# EAGLE design Clock (EAGLE 9.6.2)
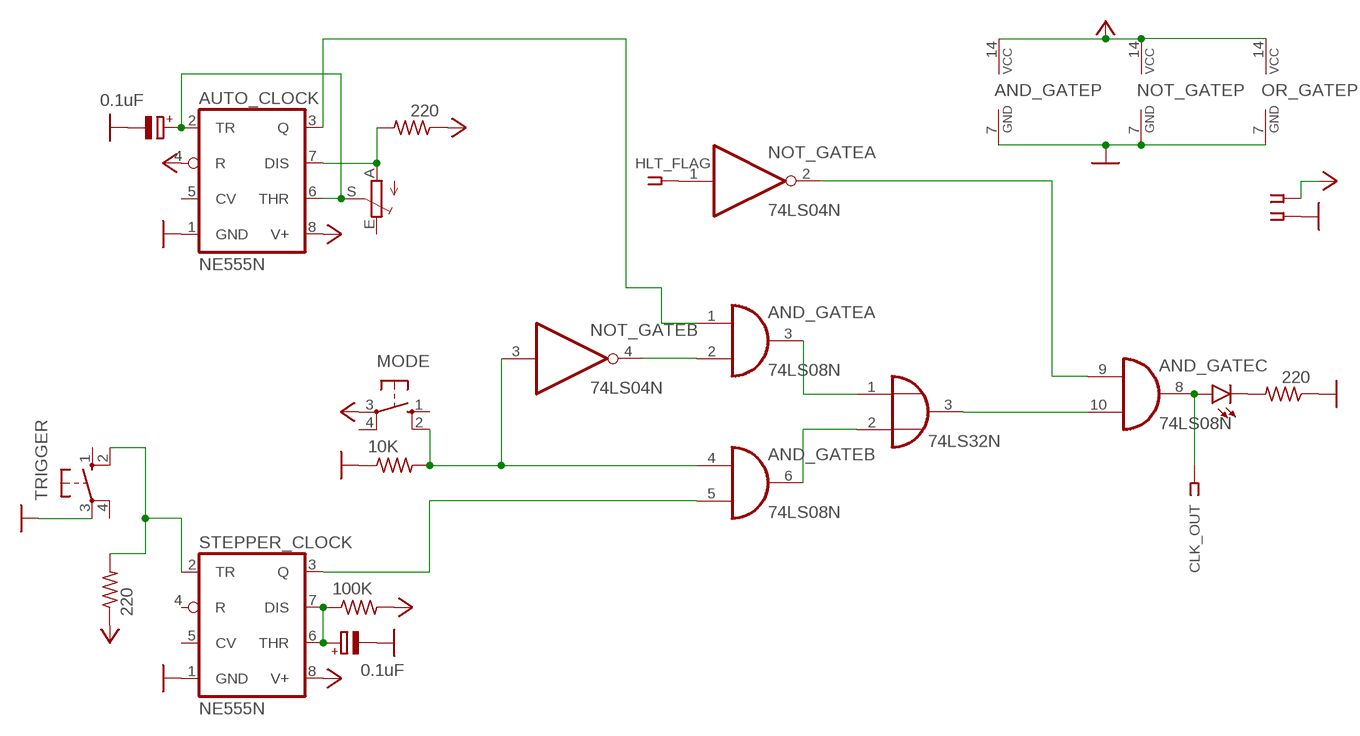
[diagram p0: schematic, sheet 1]

## Parts
AND_GATE  74LS08N  [DIL14]
AUTO_CLOCK  NE555N  [DIL08]
C1  0.1uF  CPOL-EUE2-5  [E2-5]
C2  0.1uF  CPOL-EUE2-5  [E2-5]
CLK_OUT  SSW-101-02-G-S-RA  [SSW-101-02-G-S-RA]
CLOCK  LED5MM  [LED5MM]
FREQUENCY  TRIM_EU-RJ9W  [RJ9W]
GND  SSW-101-02-G-S-RA  [SSW-101-02-G-S-RA]
HLT_FLAG  SSW-101-02-G-S-RA  [SSW-101-02-G-S-RA]
MODE  10-XX  [B3F-10XX]
NOT_GATE  74LS04N  [DIL14]
OR_GATE  74LS32N  [DIL14]
R2  220  R-US_0204/7  [0204/7]
R3  100K  R-US_0204/7  [0204/7]
R4  10K  R-US_0204/7  [0204/7]
R5  220  R-US_0204/7  [0204/7]
R6  220  R-US_0204/7  [0204/7]
STEPPER_CLOCK  NE555N  [DIL08]
TRIGGER  10-XX  [B3F-10XX]
VCC  SSW-101-02-G-S-RA  [SSW-101-02-G-S-RA]

## Nets
+5V: AND_GATE.14(P:VCC) AUTO_CLOCK.4(R) AUTO_CLOCK.8(V+) MODE.3(P) NOT_GATE.14(P:VCC) OR_GATE.14(P:VCC) R2.1 R3.2 R6.1 STEPPER_CLOCK.8(V+) VCC.1
GND: AND_GATE.7(P:GND) AUTO_CLOCK.1(GND) C1.- C2.- GND.1 NOT_GATE.7(P:GND) OR_GATE.7(P:GND) R4.1 R5.1 STEPPER_CLOCK.1(GND) TRIGGER.3(P)
N$1: C2.+ R3.1 STEPPER_CLOCK.6(THR) STEPPER_CLOCK.7(DIS)
N$2: R2.2 STEPPER_CLOCK.2(TR) TRIGGER.2(S1)
N$3: CLOCK.K(C) R5.2
N$4: AND_GATE.5(B:I1) STEPPER_CLOCK.3(Q)
N$5: AUTO_CLOCK.2(TR) AUTO_CLOCK.6(THR) C1.+ FREQUENCY.S
N$6: AND_GATE.1(A:I0) AUTO_CLOCK.3(Q)
N$7: AND_GATE.8(C:O) CLK_OUT.1 CLOCK.A
N$9: AND_GATE.2(A:I1) NOT_GATE.4(B:O)
N$10: AND_GATE.4(B:I0) MODE.2(S1) NOT_GATE.3(B:I) R4.2
N$11: AND_GATE.10(C:I1) OR_GATE.3(A:O)
N$12: AND_GATE.9(C:I0) NOT_GATE.2(A:O)
N$13: AND_GATE.3(A:O) OR_GATE.1(A:I0)
N$14: AND_GATE.6(B:O) OR_GATE.2(A:I1)
N$15: HLT_FLAG.1 NOT_GATE.1(A:I)
N$16: AUTO_CLOCK.7(DIS) FREQUENCY.A R6.2
Unconnected: AND_GATE.11(D:O) AND_GATE.12(D:I0) AND_GATE.13(D:I1) AUTO_CLOCK.5(CV) FREQUENCY.E MODE.1(S) MODE.4(P1) NOT_GATE.5(C:I) NOT_GATE.6(C:O) NOT_GATE.8(D:O) NOT_GATE.9(D:I) NOT_GATE.10(E:O) NOT_GATE.11(E:I) NOT_GATE.12(F:O) NOT_GATE.13(F:I) OR_GATE.4(B:I0) OR_GATE.5(B:I1) OR_GATE.6(B:O) OR_GATE.8(C:O) OR_GATE.9(C:I0) OR_GATE.10(C:I1) OR_GATE.11(D:O) OR_GATE.12(D:I0) OR_GATE.13(D:I1) STEPPER_CLOCK.4(R) STEPPER_CLOCK.5(CV) TRIGGER.1(S) TRIGGER.4(P1)

## Library data of the parts
AND_GATE = 74xx-eu:74*08: Quad 2-input AND gate
AUTO_CLOCK STEPPER_CLOCK = linear:*555: TIMER
C1 C2 = rcl:CPOL-EU: POLARIZED CAPACITOR, European symbol; SPICEPREFIX: C
CLK_OUT GND HLT_FLAG VCC = con-samtec:SSW-101-02-G-S: THROUGH-HOLE .025" SQ POST SOCKET Source: Samtec SSW.pdf; MF: Samtec Inc.; MPN: SSW-101-02-G-S-RA; OC_FARNELL: unknown; OC_NEWARK: 11P9337
CLOCK = led:LED: LED OSRAM: - CHIPLED LG R971, LG N971, LY N971, LG Q971, LY Q971, LO R971, LY R971 LH N974, LH R974 LS Q976, LO Q976, LY Q976 LO Q996 - Hyper CHIPLED LW Q18S LB Q993, LB Q99A, LB R99A - SideLED LS A670, LO A670, LY A670, LG A670, LP A670 LB A673, LV A673, LT A673, LW A673 LH A674 LY A675 LS A676, LA A676, LO A676, LY A676, LW A676 LS A679, LY A679, LG A679 - Hyper Micro SIDELED® LS Y876, LA Y876, LO Y876, LY Y876 LT Y87S - SmartLED LW L88C, LW L88S LB L89C, LB L89S, LG L890 LS L89K, LO L89K, LY L89K LS L896, LA L896, LO L896, LY L896 - TOPLED LS T670, LO T670, LY T670, LG T670, LP T670 LSG T670, LSP T670, LSY T670, LOP T670, LYG T670 LG T671, LOG T671, LSG T671 LB T673, LV T673, LT T673, LW T673 LH T674 LS T676, LA T676, LO T676, LY T676, LB T676, LH T676, LSB T676, LW T676 LB T67C, LV T67C, LT T67C, LS T67K, LO T67K, LY T67K, LW E67C LS E67B, LA E67B, LO E67B, LY E67B, LB E67C, LV E67C, LT E67C LW T67C LS T679, LY T679, LG T679 LS T770, LO T770, LY T770, LG T770, LP T770 LB T773, LV T773, LT T773, LW T773 LH T774 LS E675, LA E675, LY E675, LS T675 LS T776, LA T776, LO T776, LY T776, LB T776 LHGB T686 LT T68C, LB T68C - Hyper Mini TOPLED® LB M676 - Mini TOPLED Santana® LG M470 LS M47K, LO M47K, LY M47K Source: http://www.osram.convergy.de LUXEON: - LUMILED® LXK2-PW12-R00, LXK2-PW12-S00, LXK2-PW14-U00, LXK2-PW14-V00 LXK2-PM12-R00, LXK2-PM12-S00, LXK2-PM14-U00 LXK2-PE12-Q00, LXK2-PE12-R00, LXK2-PE12-S00, LXK2-PE14-T00, LXK2-PE14-U00 LXK2-PB12-K00, LXK2-PB12-L00, LXK2-PB12-M00, LXK2-PB14-N00, LXK2-PB14-P00, LXK2-PB14-Q00 LXK2-PR12-L00, LXK2-PR12-M00, LXK2-PR14-Q00, LXK2-PR14-R00 LXK2-PD12-Q00, LXK2-PD12-R00, LXK2-PD12-S00 LXK2-PH12-R00, LXK2-PH12-S00 LXK2-PL12-P00, LXK2-PL12-Q00, LXK2-PL12-R00 Source: www.luxeon.com KINGBRIGHT: KA-3528ASYC Source: www.kingbright.com
FREQUENCY = pot:TRIM_EU-: POTENTIOMETER
MODE TRIGGER = switch-omron:10-XX: OMRON SWITCH; MPN: B3F-1000; OC_FARNELL: 176432; OC_NEWARK: 36M3542
NOT_GATE = 74xx-eu:74*04: Hex INVERTER
OR_GATE = 74xx-eu:74*32: Quad 2-input OR gate
R2-R6 = rcl:R-US_: RESISTOR, American symbol; SPICEPREFIX: R

## Board
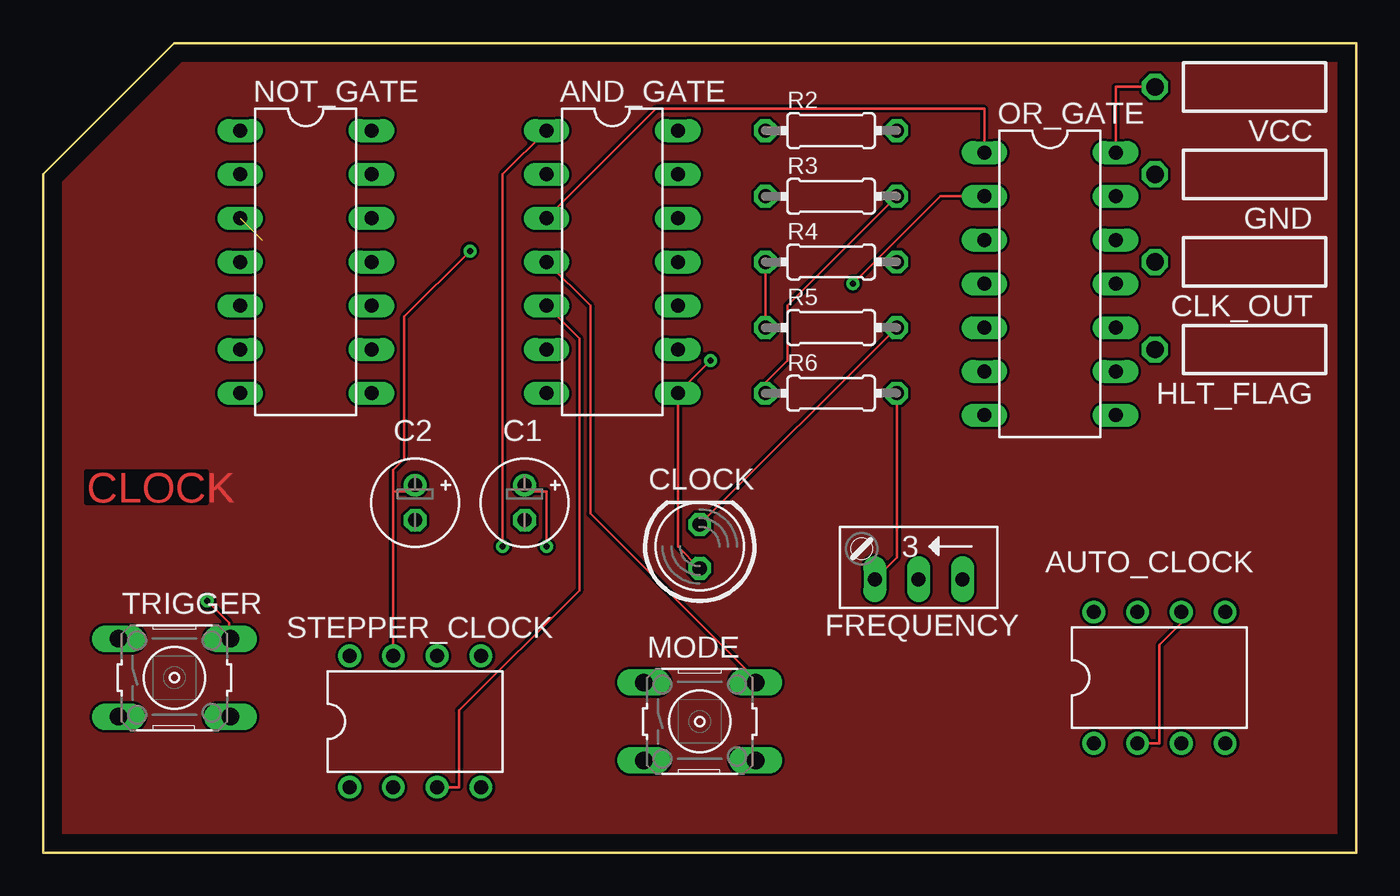
[diagram p1: board, top side]
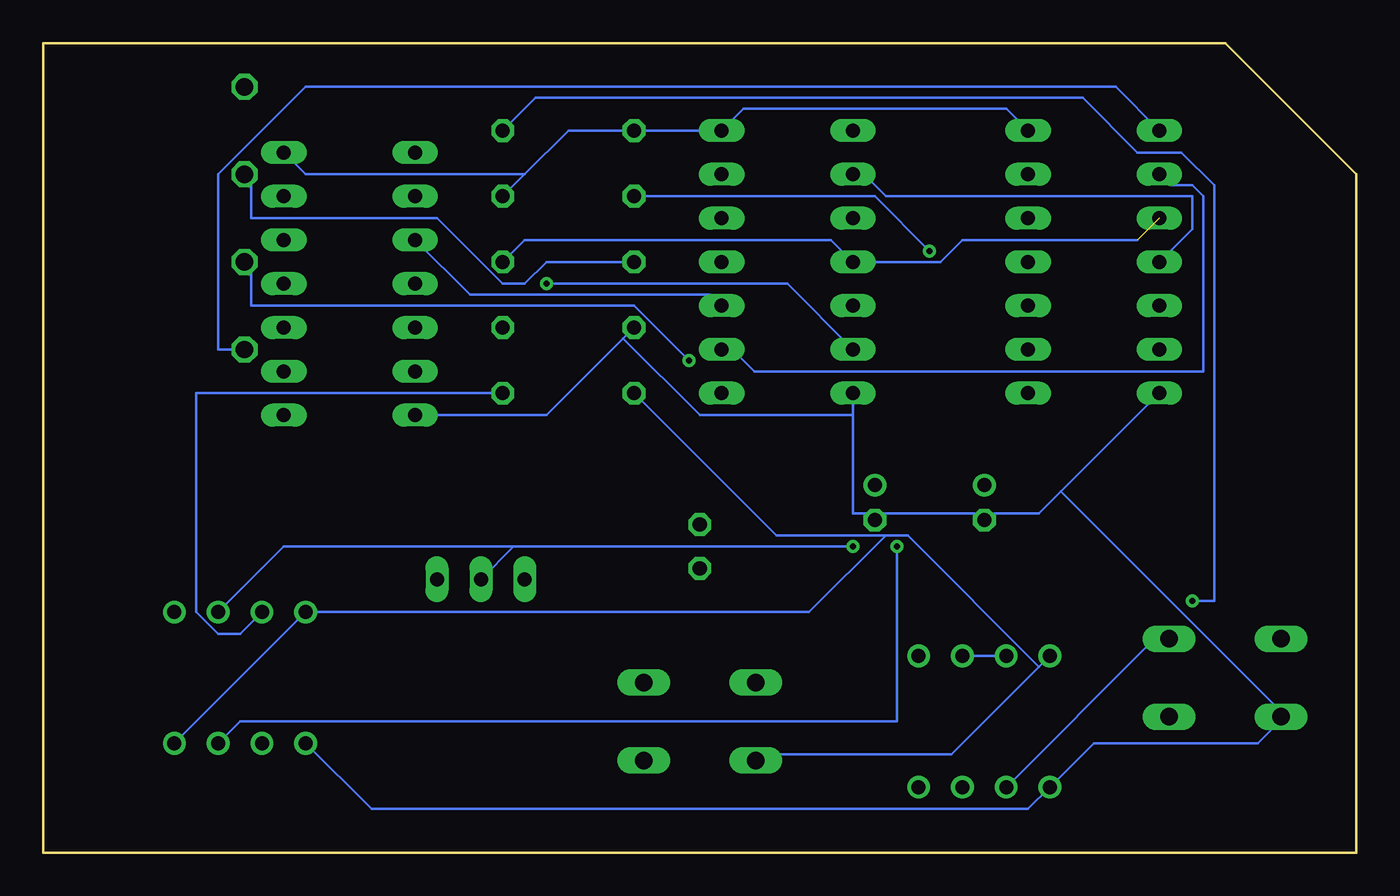
[diagram p2: board, bottom side, seen from below]

Size 76.2 x 46.99 mm. Coordinates in mm from the lower left corner, seen from the top.
Outline: 0,0 76.2,0 76.2,46.99 7.62,46.99 0,39.37 0,0
Copper layers (1*16): Top 0.035mm / dielectric 1.5mm / Bottom 0.035mm
Design rules "default": minimum track width 6mil, minimum drill 0.35mm, track to track 6mil, track to pad 6mil, pad to pad 6mil, via to via 6mil, smd to smd 6mil, copper to edge 40mil, drill to drill 6mil, minimum pad ring 10mil, minimum via ring 8mil, stop-mask expansion 4mil, vias tented up to drill 0mil, thermal gap 10mil

### Footprints (pad centres in the part's own frame; a part is rotated, then mirrored left to right if it is on the bottom)
DIL14 = drill 0.813 long: 1 -7.62,-3.81; 2 -5.08,-3.81; 3 -2.54,-3.81; 4 0,-3.81; 5 2.54,-3.81; 6 5.08,-3.81; 7 7.62,-3.81; 8 7.62,3.81; 9 5.08,3.81; 10 2.54,3.81; 11 0,3.81; 12 -2.54,3.81; 13 -5.08,3.81; 14 -7.62,3.81
DIL08 = drill 0.813 pad 1.27: 1 -3.81,-3.81; 2 -1.27,-3.81; 3 1.27,-3.81; 4 3.81,-3.81; 5 3.81,3.81; 6 1.27,3.81; 7 -1.27,3.81; 8 -3.81,3.81
E2-5 = drill 0.813 pad 1.27: + -1.016,0 | drill 0.813 pad 1.27 octagon: - 1.016,0
SSW-101-02-G-S-RA = drill 1 pad 1.5 octagon: 1 0,1.524
LED5MM = drill 0.813 octagon: A -1.27,0; K 1.27,0
RJ9W = drill 0.813 long: A 2.54,0.635; E -2.54,0.635; S 0,0.635
B3F-10XX = drill 1.016 long: 1 -3.251,2.261; 2 3.251,2.261; 3 -3.251,-2.261; 4 3.251,-2.261
0204/7 = drill 0.813 octagon: 1 -3.81,0; 2 3.81,0

### Placement (x,y rotation side)
AND_GATE  33.02,34.29 270 top
AUTO_CLOCK  64.77,10.16 0 top
C1  27.94,20.32 270 top
C2  21.59,20.32 270 top
CLK_OUT  66.04,34.29 90 top
CLOCK  38.1,17.78 90 top
FREQUENCY  50.8,16.51 180 top
GND  66.04,39.37 90 top
HLT_FLAG  66.04,29.21 90 top
MODE  38.1,7.62 0 top
NOT_GATE  15.24,34.29 270 top
OR_GATE  58.42,33.02 270 top
R2  45.72,41.91 0 top
R3  45.72,38.1 0 top
R4  45.72,34.29 0 top
R5  45.72,30.48 0 top
R6  45.72,26.67 0 top
STEPPER_CLOCK  21.59,7.62 0 top
TRIGGER  7.62,10.16 0 top
VCC  66.04,44.45 90 top

### Tracks (layer width: path | path; a pad name or v marks a point on that pad's centre or on a via)
+5V
  Top 0.152: VCC.1 62.23,44.45 OR_GATE.14 | R3.2 43.18,31.75 43.18,28.58 41.91,27.3 R6.1
  Bottom 0.152: NOT_GATE.14 20.32,43.18 35.56,43.18 AND_GATE.14 R2.1 45.72,41.91 48.26,39.37 | 48.26,39.37 R3.2 | OR_GATE.14 60.96,39.37 48.26,39.37 | AUTO_CLOCK.4 AUTO_CLOCK.8 31.75,13.97 27.31,18.41 | 18.41,10.8 23.5,5.71 34.29,5.71 MODE.3 | 18.41,10.8 STEPPER_CLOCK.8 | R6.1 33.66,18.41 27.31,18.41 | 27.31,18.41 26.04,18.41 18.41,10.8
GND
  Top 0.152: R4.1 R5.1
  Bottom 0.152: OR_GATE.7 46.99,25.4 42.55,29.84 | R5.1 42.55,29.84 | R4.1 46.99,34.29 48.26,33.02 49.53,33.02 53.34,36.83 64.14,36.83 64.14,39.37 GND.1 | 27.94,19.69 21.59,19.69 | 17.14,20.95 18.41,19.69 21.59,19.69 | 17.14,20.95 NOT_GATE.7 | 21.59,19.69 C2.- | 29.21,25.4 29.21,19.69 27.94,19.69 | 29.21,25.4 AND_GATE.7 | 27.94,19.69 C1.- | AUTO_CLOCK.1 57.15,2.54 19.05,2.54 STEPPER_CLOCK.1 15.24,6.35 5.71,6.35 4.45,7.62 TRIGGER.3 4.45,8.26 17.14,20.95 | 42.55,29.84 38.1,25.4 29.21,25.4
MAIN
  pour Top: 76.2,46.99 7.62,46.99 0,39.37 0,0 76.2,0
N$1  (via drill 0.35)
  Top 0.152: 20.32,20.95 21.59,20.95 C2.+ | STEPPER_CLOCK.7 20.32,20.95 | v24.76,34.93 20.95,31.12 20.95,22.86 20.32,22.23 20.32,20.95
  Bottom 0.152: STEPPER_CLOCK.6 STEPPER_CLOCK.7 | R3.1 27.94,38.1 v24.76,34.93
N$2  (via drill 0.35)
  Top 0.152: v9.52,14.61 10.79,13.34 10.79,12.7 TRIGGER.2
  Bottom 0.152: STEPPER_CLOCK.2 12.07,12.07 11.43,12.07 TRIGGER.2 | R2.2 47.62,43.82 15.88,43.82 12.7,40.64 10.16,40.64 8.25,38.74 8.25,14.61 v9.52,14.61
N$3
  Top 0.152: R5.2 CLOCK.K
N$4
  Top 0.152: STEPPER_CLOCK.3 24.13,3.81 24.13,8.26 31.11,15.24 31.11,29.84 AND_GATE.5
N$5  (via drill 0.35)
  Top 0.152: AUTO_CLOCK.2 64.77,6.35 64.77,12.07 66.04,13.34 AUTO_CLOCK.6 | v29.21,17.78 29.21,20.95 27.94,20.95 C1.+
  Bottom 0.152: 48.89,17.78 v29.21,17.78 | FREQUENCY.S 48.89,17.78 | AUTO_CLOCK.6 62.23,17.78 48.89,17.78
N$6  (via drill 0.35)
  Top 0.152: AND_GATE.1 26.67,39.37 v26.67,17.78
  Bottom 0.152: v26.67,17.78 26.67,7.62 64.77,7.62 AUTO_CLOCK.3
N$7  (via drill 0.35)
  Top 0.152: CLOCK.A 36.83,17.78 AND_GATE.8 v38.73,28.58
  Bottom 0.152: v38.73,28.58 41.91,31.75 64.14,31.75 64.14,34.29 CLK_OUT.1
N$9
  Bottom 0.152: NOT_GATE.4 9.52,36.2 9.52,38.1 27.31,38.1 28.57,39.37 AND_GATE.2
N$10  (1 unrouted)
  Top 0.152: AND_GATE.4 31.75,31.75 31.75,19.69 41.28,10.16 MODE.2
  Bottom 0.152: R4.2 48.26,35.56 30.48,35.56 AND_GATE.4 24.13,34.29 22.86,35.56 12.7,35.56
N$11
  Bottom 0.152: AND_GATE.10 37.47,32.38 51.44,32.38 OR_GATE.3
N$12
  Bottom 0.152: NOT_GATE.2 10.79,38.74 9.52,38.74 8.89,38.1 8.89,27.94 34.92,27.94 36.19,29.21 AND_GATE.9
N$13
  Top 0.152: AND_GATE.3 35.56,43.18 54.61,43.18 OR_GATE.1
N$14  (via drill 0.35)
  Top 0.152: v46.99,33.02 52.07,38.1 OR_GATE.2
  Bottom 0.152: AND_GATE.6 33.02,33.02 v46.99,33.02
N$15
  Bottom 0.152: NOT_GATE.1 13.97,44.45 60.96,44.45 66.04,39.37 66.04,29.21 HLT_FLAG.1
N$16
  Top 0.152: FREQUENCY.A 49.53,17.15 R6.2
  Bottom 0.152: AUTO_CLOCK.7 64.77,12.7 66.04,12.7 67.31,13.97 67.31,26.67 R6.2

### Text on the board
Top: CLOCK